# EAGLE schematic untitled (EAGLE 9.3.0)
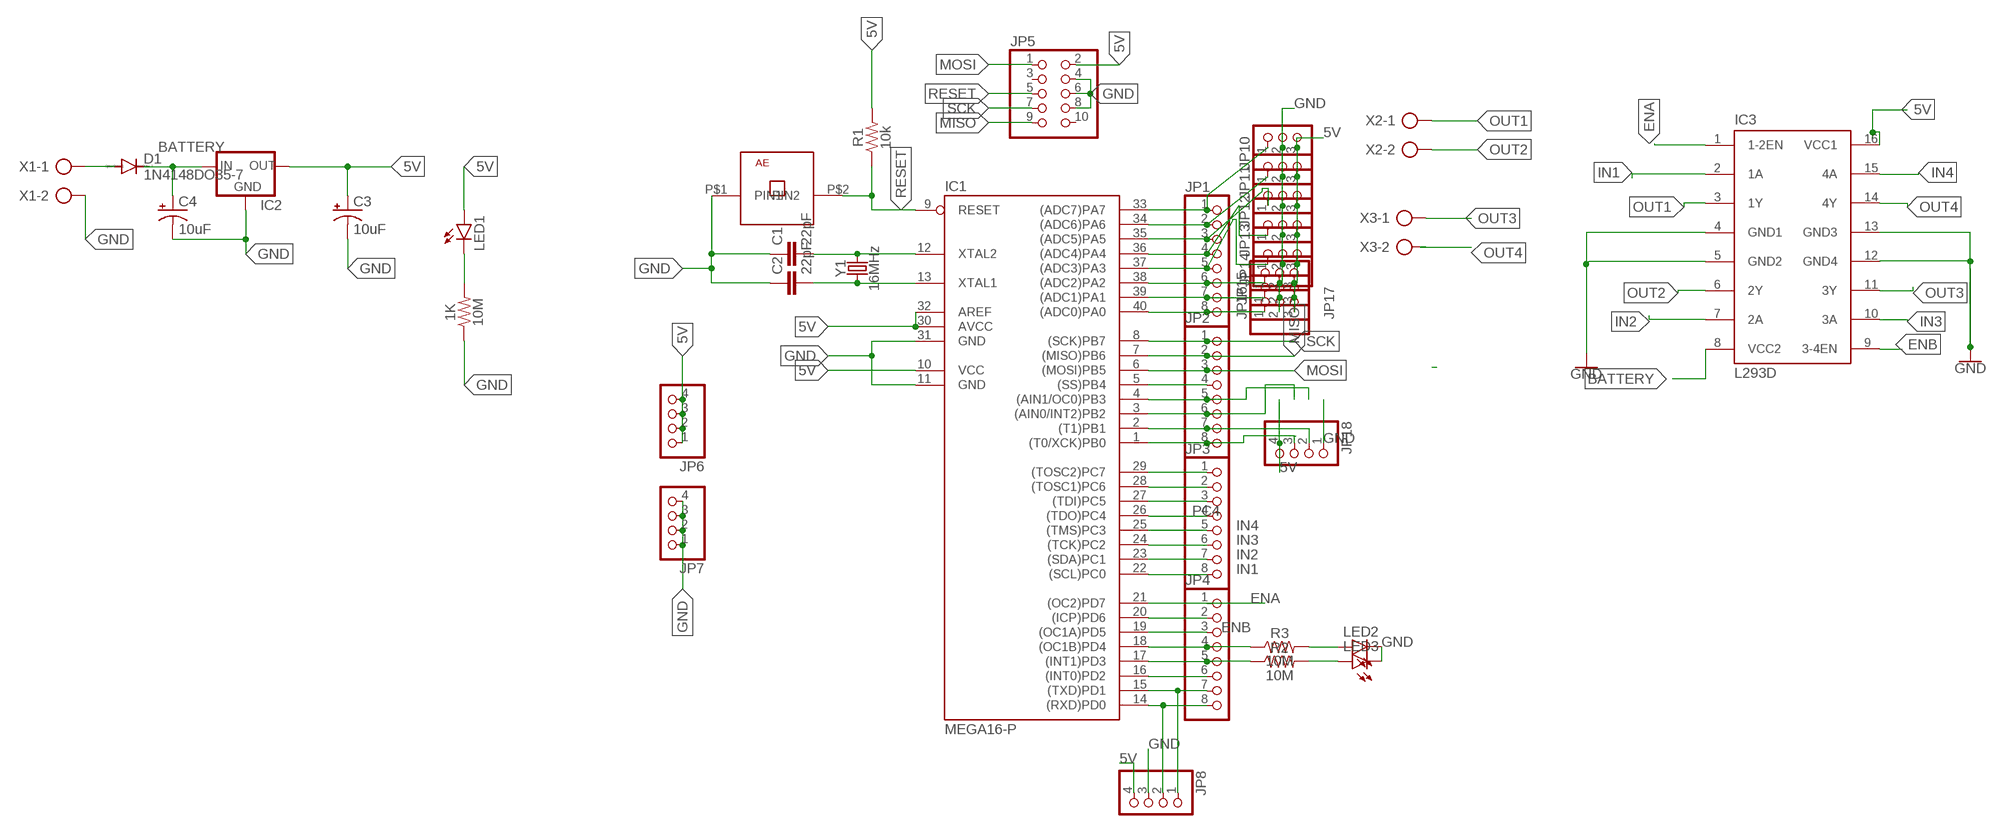
[diagram p0: schematic, sheet 1]

## Parts
1K  10M  10MOHM-HORIZ-1/4W-5%  [AXIAL-0.3]
C1  22pF  22PF-PTH-2.54MM-200V-5%  [CAP-PTH-2.54]
C2  22pF  22PF-PTH-2.54MM-200V-5%  [CAP-PTH-2.54]
C3  10uF  10UF-POLAR-RADIAL-2.5MM-25V-20%  [CPOL-RADIAL-2.5MM-5MM]
C4  10uF  10UF-POLAR-RADIAL-2.5MM-25V-20%  [CPOL-RADIAL-2.5MM-5MM]
D1  1N4148DO35-7  [DO35-7]
IC1  MEGA16-P  [DIL40]
IC2  78XXS  [78XXS]
IC3  L293D  [DIL16]
JP1  PINHD-1X8  [1X08]
JP2  PINHD-1X8  [1X08]
JP3  PINHD-1X8  [1X08]
JP4  PINHD-1X8  [1X08]
JP5  PINHD-2X5  [2X05]
JP6  PINHD-1X4  [1X04]
JP7  PINHD-1X4  [1X04]
JP8  PINHD-1X4  [1X04]
JP10  PINHD-1X3  [1X03]
JP11  PINHD-1X3  [1X03]
JP12  PINHD-1X3  [1X03]
JP13  PINHD-1X3  [1X03]
JP14  PINHD-1X3  [1X03]
JP15  PINHD-1X3  [1X03]
JP16  PINHD-1X3  [1X03]
JP17  PINHD-1X3  [1X03]
JP18  PINHD-1X4  [1X04]
LED1  LED3MM  [LED3MM]
LED2  LED3MM  [LED3MM]
LED3  LED3MM  [LED3MM]
R1  10k  10MOHM-HORIZ-1/4W-5%  [AXIAL-0.3]
R2  10M  10MOHM-HORIZ-1/4W-5%  [AXIAL-0.3]
R3  10M  10MOHM-HORIZ-1/4W-5%  [AXIAL-0.3]
U$1  PUSHBUTTON-AE  [PUSHBUTTON-AE]
X1  AK500/2-H  [AK500/2-H]
X2  AK500/2-H  [AK500/2-H]
X3  AK500/2-H  [AK500/2-H]
Y1  16MHz  CRYSTAL-16MHZPTH-HC49US  [HC49US]

## Nets
5V: C3.1(+) IC1.10(VCC) IC1.30(AVCC) IC1.32(AREF) IC2.OUT IC3.16(VCC1) JP5.2 JP6.1 JP6.2 JP6.3 JP6.4 JP8.4 JP10.3 JP11.3 JP12.3 JP13.3 JP14.3 JP15.3 JP16.3 JP17.3 JP18.4 LED1.A R1.P$2
BATTERY: C4.1(+) D1.C IC2.IN IC3.8(VCC2)
ENA: IC1.21((OC2)PD7) IC3.1(1-2EN) JP4.1
ENB: IC1.19((OC1A)PD5) IC3.9(3-4EN) JP4.3
GND: 1K.P$1 C1.1 C2.1 C3.2(-) C4.2(-) IC1.11(GND) IC1.31(GND) IC2.GND IC3.4(GND1) IC3.5(GND2) IC3.12(GND4) IC3.13(GND3) JP5.4 JP5.6 JP5.8 JP7.1 JP7.2 JP7.3 JP7.4 JP8.3 JP10.2 JP11.2 JP12.2 JP13.2 JP14.2 JP15.2 JP16.2 JP17.2 JP18.1 LED2.K(C) LED3.K(C) U$1.P$1(PIN1) X1.2
IN1: IC1.22((SCL)PC0) IC3.2(1A) JP3.8
IN2: IC1.23((SDA)PC1) IC3.7(2A) JP3.7
IN3: IC1.24((TCK)PC2) IC3.10(3A) JP3.6
IN4: IC1.25((TMS)PC3) IC3.15(4A) JP3.5
MISO: IC1.7((MISO)PB6) JP2.2 JP5.9
MOSI: IC1.6((MOSI)PB5) JP2.3 JP5.1
N$1: C1.2 IC1.12(XTAL2) Y1.2
N$2: C2.2 IC1.13(XTAL1) Y1.1
N$3: LED2.A R3.P$2
N$4: 1K.P$2 LED1.K(C)
N$5: LED3.A R2.P$2
N$6: D1.A X1.1
N$7: IC1.33((ADC7)PA7) JP1.1 JP10.1
N$8: IC1.34((ADC6)PA6) JP1.2 JP11.1
N$9: IC1.35((ADC5)PA5) JP1.3 JP12.1
N$10: IC1.36((ADC4)PA4) JP1.4 JP13.1
N$11: IC1.37((ADC3)PA3) JP1.5 JP14.1
N$12: IC1.38((ADC2)PA2) JP1.6 JP15.1
N$13: IC1.39((ADC1)PA1) JP1.7 JP16.1
N$14: IC1.40((ADC0)PA0) JP1.8 JP17.1
N$18: IC1.5((SS)PB4) JP2.4
N$19: IC1.4((AIN1/OC0)PB3) JP2.5
N$20: IC1.3((AIN0/INT2)PB2) JP2.6
N$21: IC1.2((T1)PB1) JP2.7 JP18.2
N$22: IC1.1((T0/XCK)PB0) JP2.8 JP18.3
N$23: IC1.29((TOSC2)PC7) JP3.1
N$24: IC1.28((TOSC1)PC6) JP3.2
N$25: IC1.27((TDI)PC5) JP3.3
N$32: IC1.20((ICP)PD6) JP4.2
N$34: IC1.18((OC1B)PD4) JP4.4 R3.P$1
N$35: IC1.17((INT1)PD3) JP4.5 R2.P$1
N$36: IC1.16((INT0)PD2) JP4.6
N$37: IC1.15((TXD)PD1) JP4.7 JP8.1
N$38: IC1.14((RXD)PD0) JP4.8 JP8.2
OUT1: IC3.3(1Y) X2.1
OUT2: IC3.6(2Y) X2.2
OUT3: IC3.11(3Y) X3.1
OUT4: IC3.14(4Y) X3.2
PC4: IC1.26((TDO)PC4) JP3.4
RESET: IC1.9(RESET) JP5.5 R1.P$1 U$1.P$2(PIN2)
SCK: IC1.8((SCK)PB7) JP2.1 JP5.7
Unconnected: JP5.3 JP5.10

## Library data of the parts
1K R2 R3 = SparkFun-Resistors:10MOHM: RES-09327; PROD_ID: RES-09327
C1 C2 = SparkFun-Capacitors:22PF: 22pF ceramic capacitors A capacitor is a passive two-terminal electrical component used to store electrical energy temporarily in an electric field.; PROD_ID: CAP-09128
C3 C4 = SparkFun-Capacitors:10UF-POLAR: 10.0µF polarized capacitors A capacitor is a passive two-terminal electrical component used to store electrical energy temporarily in an electric field.; PROD_ID: CAP-08440
D1 = diode:1N4148: DIODE high speed (Philips)
IC1 = atmel:MEGA16-P: MICROCONTROLLER 16 Kbytes FLASH 1 kbytes SRAM 512 bytes EEPROM USART 8-channel 10 bit ADC Source: avr.lbr; MPN: ATMEGA16-16PU; OC_FARNELL: 9171142; OC_NEWARK: 01M6885
IC2 = v-reg:78XXS: VOLTAGE REGULATOR
IC3 = st-microelectronics:L293D: PUSH-PULL 4 CHANNEL DRIVER; MPN: L293D; OC_FARNELL: 9589619; OC_NEWARK: 56P8249
JP1-JP4 = pinhead:PINHD-1X8: PIN HEADER
JP5 = pinhead:PINHD-2X5: PIN HEADER
JP6-JP8 JP18 = pinhead:PINHD-1X4: PIN HEADER
JP10-JP17 = pinhead:PINHD-1X3: PIN HEADER
LED1-LED3 = led:LED: LED OSRAM: - CHIPLED LG R971, LG N971, LY N971, LG Q971, LY Q971, LO R971, LY R971 LH N974, LH R974 LS Q976, LO Q976, LY Q976 LO Q996 - Hyper CHIPLED LW Q18S LB Q993, LB Q99A, LB R99A - SideLED LS A670, LO A670, LY A670, LG A670, LP A670 LB A673, LV A673, LT A673, LW A673 LH A674 LY A675 LS A676, LA A676, LO A676, LY A676, LW A676 LS A679, LY A679, LG A679 - Hyper Micro SIDELED® LS Y876, LA Y876, LO Y876, LY Y876 LT Y87S - SmartLED LW L88C, LW L88S LB L89C, LB L89S, LG L890 LS L89K, LO L89K, LY L89K LS L896, LA L896, LO L896, LY L896 - TOPLED LS T670, LO T670, LY T670, LG T670, LP T670 LSG T670, LSP T670, LSY T670, LOP T670, LYG T670 LG T671, LOG T671, LSG T671 LB T673, LV T673, LT T673, LW T673 LH T674 LS T676, LA T676, LO T676, LY T676, LB T676, LH T676, LSB T676, LW T676 LB T67C, LV T67C, LT T67C, LS T67K, LO T67K, LY T67K, LW E67C LS E67B, LA E67B, LO E67B, LY E67B, LB E67C, LV E67C, LT E67C LW T67C LS T679, LY T679, LG T679 LS T770, LO T770, LY T770, LG T770, LP T770 LB T773, LV T773, LT T773, LW T773 LH T774 LS E675, LA E675, LY E675, LS T675 LS T776, LA T776, LO T776, LY T776, LB T776 LHGB T686 LT T68C, LB T68C - Hyper Mini TOPLED® LB M676 - Mini TOPLED Santana® LG M470 LS M47K, LO M47K, LY M47K Source: http://www.osram.convergy.de LUXEON: - LUMILED® LXK2-PW12-R00, LXK2-PW12-S00, LXK2-PW14-U00, LXK2-PW14-V00 LXK2-PM12-R00, LXK2-PM12-S00, LXK2-PM14-U00 LXK2-PE12-Q00, LXK2-PE12-R00, LXK2-PE12-S00, LXK2-PE14-T00, LXK2-PE14-U00 LXK2-PB12-K00, LXK2-PB12-L00, LXK2-PB12-M00, LXK2-PB14-N00, LXK2-PB14-P00, LXK2-PB14-Q00 LXK2-PR12-L00, LXK2-PR12-M00, LXK2-PR14-Q00, LXK2-PR14-R00 LXK2-PD12-Q00, LXK2-PD12-R00, LXK2-PD12-S00 LXK2-PH12-R00, LXK2-PH12-S00 LXK2-PL12-P00, LXK2-PL12-Q00, LXK2-PL12-R00 Source: www.luxeon.com KINGBRIGHT: KA-3528ASYC Source: www.kingbright.com
R1 = SparkFun-Resistors:10MOHM: RES-09327; PROD_ID: RES-09327; VALUE: 10M
U$1 = PushButton-AE:PUSHBUTTON-AE: This is 2 pin push button designed by the one and only Alaa Essam وماعندناش داتا شيت ان كان عاجبك
X1-X3 = con-ptr500:AK500/2-H: CONNECTOR Aug. 2004 / PTR Meßtechnik: Die Bezeichnung der Serie AK505 wurde geändert. Es handelt sich hierbei um AK500 in horizontaler Ausführung.; OC_FARNELL: unknown; OC_NEWARK: unknown
Y1 = SparkFun-Clocks:CRYSTAL-16MHZ: 16MHz Crystal Digikey Example <http://www.digikey.com/product-search/en?keywords=535-9122-1-ND> Frequency: 16MHz Frequency Stability: ±50ppm Frequency Tolerance: ±20ppm Load Capacitance: 18pF SparkFun Products: Pro Micro -5V/16MHz <https://www.sparkfun.com/products/12640> SparkFun Serial Enabled LCD Kit <https://www.sparkfun.com/products/10097>; PROD_ID: XTAL-08181; SF_ID: COM-00536